# Altium schematic sheet 12V_Buck.SchDoc
size 259 x 167 mm; SheetNumber: 2; SheetTotal: 2
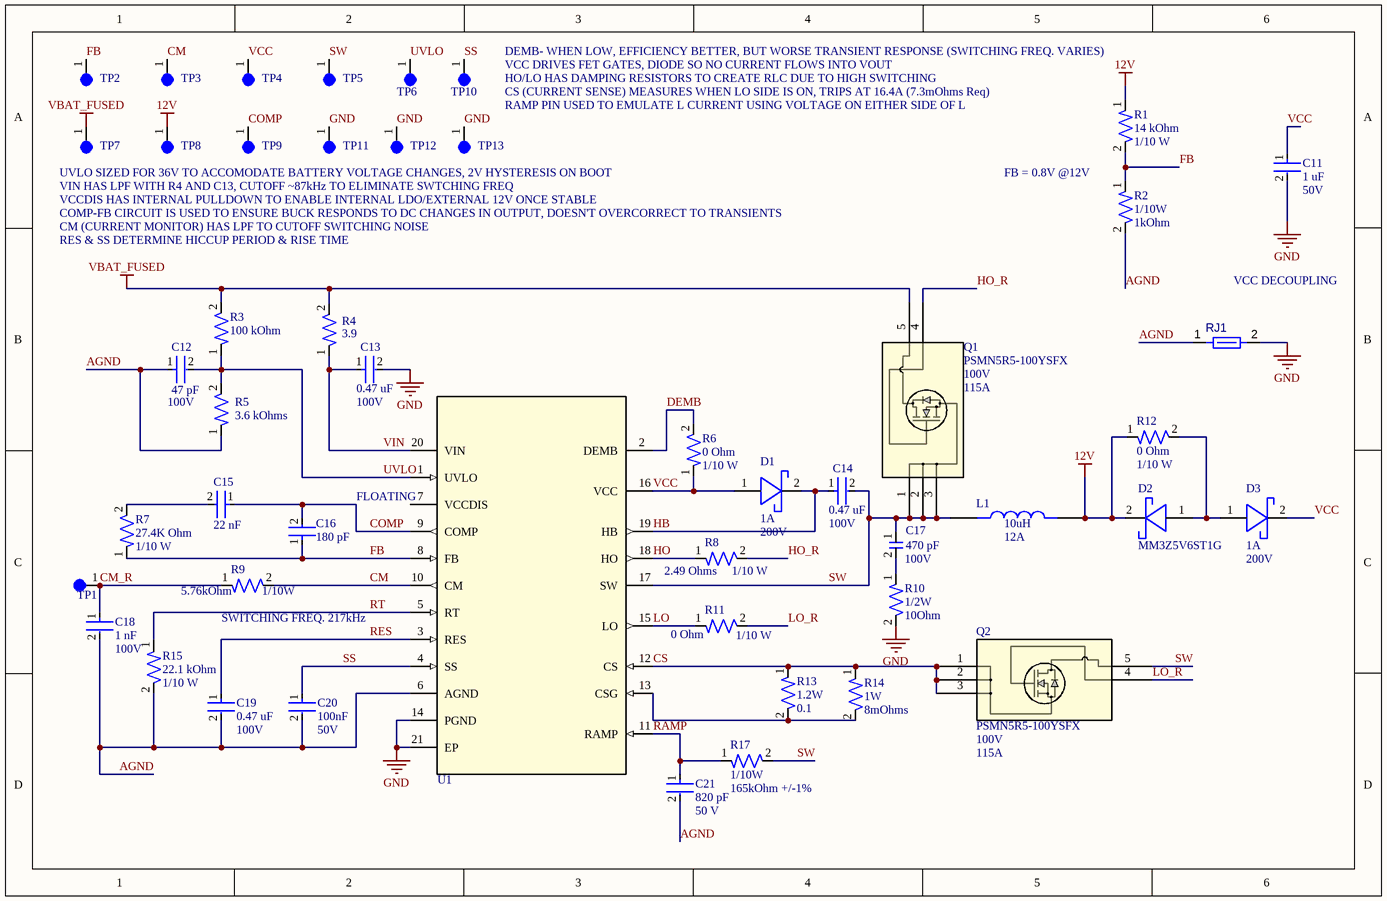
[diagram p0: 12V_Buck.SchDoc]

## Parts
C11  Capacitance: 1 uF  Voltage: 50V  [CAP-0603]  (hidden comment: UMK107AB7105KA-T)
C12  Capacitance: 47 pF  Voltage Rating: 100V  [CAP-0603]  (hidden comment: 7447798111)
C13  Capacitance: 0.47 uF  Voltage: 100V  [CAP-0805]  (hidden comment: KAM21KR72A474KL)
C14  Capacitance: 0.47 uF  Voltage: 100V  [CAP-0805]  (hidden comment: KAM21KR72A474KL)
C15  Capacitance: 22 nF  [CAP-0603]  (hidden comment: C0603C223K3RAC7867)
C16  Capacitance: 180 pF  [CAP-0603]  (hidden comment: CC0603JRNPO9BN181)
C17  Capacitance: 470 pF  voltage: 100V  [CAP-0603]  (hidden comment: 0603B471K101CT)
C18  Capacitance: 1 nF  Voltage: 100V  [CAP-0603]  (hidden comment: C0603Y102K1RAC7867)
C19  Capacitance: 0.47 uF  Voltage: 100V  [CAP-0805]  (hidden comment: KAM21KR72A474KL)
C20  Capacitance: 100nF  Voltage Rating: 50V  [CAP-0603]  (hidden comment: CC0603KRX7R9BB104)
C21  Capacitance: 820 pF  Voltage: 50 V  [CAP-0603]  (hidden comment: C0603C821K5RACTU)
D1  Current Rating: 1A  Reverse Voltage: 200V  [SMA_DIO]  (hidden comment: SS1200)
D2  MM3Z5V6ST1G  [DIO_MM3Z3V0T1G - duplicate]
D3  Current Rating: 1A  Reverse Voltage: 200V  [SMA_DIO]  (hidden comment: SS1200)
L1  value 10uH  Current: 12A  [IND_SRP1265_BRN]  (hidden comment: SRP1265WA-100M)
Q1  PSMN5R5-100YSFX  Vdss: 100V  Drain Current: 115A  [LFPAK_SOT669_NEX]
Q2  PSMN5R5-100YSFX  Vdss: 100V  Drain Current: 115A  [LFPAK_SOT669_NEX]
R1  Resistance: 14 kOhm  Power: 1/10 W  [RES-0603]  (hidden comment: RC0603FR-0714KL)
R2  Power Rating: 1/10W  Resistance: 1kOhm  [RES-0603]  (hidden comment: RT0603FRE131KL)
R3  Resistance: 100 kOhm  [RES-0603]  (hidden comment: RC0603FR-07100KL)
R4  Parameter 1: 3.9  [RES-0805]  (hidden comment: RC0805FR-073R9L)
R5  Resistance: 3.6 kOhms  [RES-0603]  (hidden comment: RC0603FR-073K6L)
R6  Resistance: 0 Ohm  Power: 1/10 W  [RES-0603]  (hidden comment: RMCF0603ZT0R00)
R7  Resistance: 27.4K Ohm  Power: 1/10 W  [RES-0603]  (hidden comment: RC0603FR-0727K4L)
R8  Power: 1/10 W  Resistance: 2.49 Ohms  [RES-0603]  (hidden comment: RC0603FR-072R49L)
R9  Power Rating: 1/10W  Resistance: 5.76kOhm  [RES-0603]  (hidden comment: ARG03FTC5761)
R10  Power Rating: 1/2W  Resistance: 10Ohm  [RES-0603]  (hidden comment: SG73P1JTTD100J)
R11  Resistance: 0 Ohm  Power: 1/10 W  [RES-0603]  (hidden comment: RMCF0603ZT0R00)
R12  Resistance: 0 Ohm  Power: 1/10 W  [RES-0603]  (hidden comment: RMCF0603ZT0R00)
R13  Power: 1.2W  Resistance: 0.1  [RES-0805]  (hidden comment: PE0508FRE070R1L)
R14  Power: 1W  Resistance: 8mOhms  [RES-1206]  (hidden comment: PE1206FKM470R008Z)
R15  Resistance: 22.1 kOhm  Power: 1/10 W  [RES-0603]  (hidden comment: RC0603FR-0722K1L)
R17  Power Rating: 1/10W  Resistance: 165kOhm +/-1%  [RES-0603]  (hidden comment: RC0603FR-07165KL)
RJ1  Net Tie 12x8mil  [SHORT06-FP]  (value not drawn)  (net tie, no BOM)
TP1  5003  [TEST-POINT-0001]  (value not drawn)
TP2  5003  [TEST-POINT-0001]  (value not drawn)
TP3  5003  [TEST-POINT-0001]  (value not drawn)
TP4  5003  [TEST-POINT-0001]  (value not drawn)
TP5  5003  [TEST-POINT-0001]  (value not drawn)
TP6  5003  [TEST-POINT-0001]  (value not drawn)
TP7  5003  [TEST-POINT-0001]  (value not drawn)
TP8  5003  [TEST-POINT-0001]  (value not drawn)
TP9  5003  [TEST-POINT-0001]  (value not drawn)
TP10  5003  [TEST-POINT-0001]  (value not drawn)
TP11  5003  [TEST-POINT-0001]  (value not drawn)
TP12  5003  [TEST-POINT-0001]  (value not drawn)
TP13  5003  [TEST-POINT-0001]  (value not drawn)
U1  LM5117PMHX/NOPB  [IC-20-HTSSOP]  (value not drawn)

## Nets
12V: D2.2 L1.2 R1.1 R12.1 TP8.1
GND: C11.2 C13.2 R10.2 RJ1.2 TP11.1 TP12.1 TP13.1 U1.14(PGND) U1.21(EP)
VBAT_FUSED: Q1.5 R3.2 R4.2 TP7.1
AGND: C12.1 C18.2 C19.2 C20.2 C21.2 R2.2 R5.1 R15.2 RJ1.1 U1.6(AGND)
CM: R9.2 TP3.1 U1.10(CM)
CM_R: C18.1 R9.1 TP1.1
COMP: C15.1 C16.2 TP9.1 U1.9(COMP)
CS: Q2.1 Q2.2 Q2.3 R13.1 R14.1 U1.12(CS)
DEMB: R6.2 U1.2(DEMB)
FB: C16.1 R1.2 R2.1 R7.1 TP2.1 U1.8(FB)
HB: C14.1 D1.2(ANODE) U1.19(HB)
HO: R8.1 U1.18(HO)
HO_R: Q1.4 R8.2
LO: R11.1 U1.15(LO)
LO_R: Q2.4 R11.2
RAMP: C21.1 R17.1 U1.11(RAMP)
RES: C19.1 U1.3(RES)
RT: R15.1 U1.5(RT)
SS: C20.1 TP10.1 U1.4(SS)
SW: C14.2 C17.1 L1.1 Q1.1 Q1.2 Q1.3 Q2.5 R17.2 TP5.1 U1.17(SW)
UVLO: C12.2 R3.1 R5.2 TP6.1 U1.1(UVLO)
VCC: C11.1 D1.1(CATHODE) D3.2(ANODE) R6.1 TP4.1 U1.16(VCC)
VIN: C13.1 R4.1 U1.20(VIN)
NetC15_2: C15.2 R7.2
NetC17_2: C17.2 R10.1
NetD2_1: D2.1 D3.1(CATHODE) R12.2
NetR13_2: R13.2 R14.2 U1.13(CSG)

Not connected (* = marked no-connect by the designer): U1 7(VCCDIS)

## Notes on the sheet
- (near TP10) DEMB- WHEN LOW, EFFICIENCY BETTER, BUT WORSE TRANSIENT RESPONSE (SWITCHING FREQ. VARIES)
- (near TP10) VCC DRIVES FET GATES, DIODE SO NO CURRENT FLOWS INTO VOUT
- (near TP10) HO/LO HAS DAMPING RESISTORS TO CREATE RLC DUE TO HIGH SWITCHING
- CS (CURRENT SENSE) MEASURES WHEN LO SIDE IS ON, TRIPS AT 16.4A (7.3mOhms Req)
- RAMP PIN USED TO EMULATE L CURRENT USING VOLTAGE ON EITHER SIDE OF L
- UVLO SIZED FOR 36V TO ACCOMODATE BATTERY VOLTAGE CHANGES, 2V HYSTERESIS ON BOOT
- FB = 0.8V @12V
- VIN HAS LPF WITH R4 AND C13, CUTOFF ~87kHz TO ELIMINATE SWTCHING FREQ
- VCCDIS HAS INTERNAL PULLDOWN TO ENABLE INTERNAL LDO/EXTERNAL 12V ONCE STABLE
- COMP-FB CIRCUIT IS USED TO ENSURE BUCK RESPONDS TO DC CHANGES IN OUTPUT, DOESN'T OVERCORRECT TO TRANSIENTS
- CM (CURRENT MONITOR) HAS LPF TO CUTOFF SWITCHING NOISE
- RES & SS DETERMINE HICCUP PERIOD & RISE TIME
- VCC DECOUPLING
- (near U1) FLOATING
- (near R9) SWITCHING FREQ. 217kHz

## Library data of the parts
C11 = CAP-1U-0002: 1 µF ±10% 50V Ceramic Capacitor X7R 0603 (1608 Metric); Package Size: 0603
C12 = CAP-47P-0001: 47 pF ±5% 100V Ceramic Capacitor C0G, NP0 0603 (1608 Metric)
C13 C14 C19 = CAP-0.47U-0001: 0.47 µF ±10% 100V Ceramic Capacitor X7R 0805 (2012 Metric); Tolerance: +/- 10%; Assembled?: No; Temperature Coefficient: X7R; Package Size: 0805
C15 = CAP-22N-0001: 0.022 µF ±10% 25V Ceramic Capacitor X7R 0603 (1608 Metric); Package Size: 0603
C16 = CAP-180P-0001: 180 pF ±5% 50V Ceramic Capacitor C0G, NP0 0603 (1608 Metric); Tolerance: +/- 10%; Temperature Coefficient: X7R; Assembled?: No; Package Size: 0805; Voltage: 50V
C17 = CAP-470P-0001: 470 pF ±10% 100V Ceramic Capacitor X7R 0603 (1608 Metric); Assembled?: No; TOlerance: 10%; Package Size: 0603
C18 = CAP-1N-0001: 1000 pF ±10% 100V Ceramic Capacitor X7R 0603 (1608 Metric)
C20 = CAP-100N-0001: 0.1 µF ±10% 50V Ceramic Capacitor X7R 0603 (1608 Metric); Manufacturer Part Number: CC0603KRX7R0BB104; Manufacturer: YAGEO; Assembled?: no; Temperature Coefficient: X7R; Package Size: 0603
C21 = CAP-820P-0001: 820 pF ±10% 50V Ceramic Capacitor X7R 0603 (1608 Metric); Device Class: Ceramic; Size: 0603; ComponentLink1Description: Datasheet; ComponentLink1URL: https://www.yageo.com/upload/media/product/app/datasheet/mlcc/upy-np0x7r_mv_100-to-630v.pdf
D1 D3 = DIO-SCHOTTKY-0004: DIODE SCHOTTKY 200V 1A SMA; ComponentLink1Description: Datasheet; ComponentLink1URL: https://www.digikey.com/en/products/detail/mdd/ss1200/15911596
D2 = TESTDIOZ
L1 = IND-10U-0002: 10 µH Shielded Inductor 12 A 16.5mOhm Max Nonstandard; MP: SRP1265A-100M; Package: None; Price: None; Availability: Unavailable
Q1 Q2 = NMOS-115A-0001: N-Channel 100 V 115A (Tc) 238W (Tc) Surface Mount LFPAK56, Power-SO8; Manufacturer_Part_Number: TPH2R506PL; Vgs (max): 20V; Vgs: 4V @ 1mA; RefDes: RefDes
R1 = RES-14K-0001: 14 kOhms ±1% 0.1W, 1/10W Chip Resistor 0603 (1608 Metric) Moisture Resistant Thick Film; Tolerance: +/- 1%; Assembled?: No; Package Size: 0603
R2 = RES-1K-0002: 1 kOhms ±1% 0.1W, 1/10W Chip Resistor 0603 (1608 Metric) Thin Film; Manufacturer: YAGEO; Assembled?: no; Manufacturer Part Number: RT0603FRE131KL; Package Size: 0603
R3 = RES-100K-0003: 100 kOhms ±1% 0.1W, 1/10W Chip Resistor 0603 (1608 Metric) Moisture Resistant Thick Film; Tolerance: +/- 1%; Assembled?: No; Package Size: 0603; Power: 1/10 W
R4 = RES-3.9-0001: 3.9 Ohms ±1% 0.125W, 1/8W Chip Resistor 0805 (2012 Metric) Moisture Resistant Thick Film
R5 = RES-3.6K-0001: 3.6 kOhms ±1% 0.1W, 1/10W Chip Resistor 0603 (1608 Metric) Moisture Resistant Thick Film; Power: 1/10 W
R6 R11 R12 = RES-0-0001: 0 Ohms Jumper 0.1W, 1/10W Chip Resistor 0603 (1608 Metric) Automotive AEC-Q200 Thick Film; Package Size: 0603
R7 = RES-27.4K-0001: 27.4 kOhms ±1% 0.1W, 1/10W Chip Resistor 0603 (1608 Metric) Moisture Resistant Thick Film; assembled?: yes; JLC part number: C144778
R8 = RES-2.49-0001: 2.49 Ohms ±1% 0.1W, 1/10W Chip Resistor 0603 (1608 Metric) Moisture Resistant Thick Film
R9 = RES-5.76K-0001: 100mW Thin Film Resistor 75V ±25ppm/℃ ±1% -55℃~+155℃ 5.76kΩ 0603 Chip Resistor - Surface Mount ROHS; Manufacturer: Viking Tech; Assembled?: no; Manufacturer Part Number: ARG03FTC5761; Package Size: 0603
R10 = RES-10-0001: 10 Ohms ±5% 0.5W, 1/2W Chip Resistor 0603 (1608 Metric) Automotive AEC-Q200, Pulse Withstanding Thick Film; Manufacturer Part Number: RC0603FR-0710KP; Manufacturer: Vishay; Assembled?: no; Package Size: 0603
R13 = RES-0.1-0001: 100 mOhms ±1% 1.2W Chip Resistor Wide 0805 (2012 Metric), 0508 Automotive AEC-Q200, Current Sense Metal Element
R14 = RES-8mOhms-0001: 8 mOhms ±1% 1W Chip Resistor 1206 (3216 Metric) Current Sense Metal Foil
R15 = RES-22.1K-0001: 22.1 kOhms ±1% 0.1W, 1/10W Chip Resistor 0603 (1608 Metric) Moisture Resistant Thick Film; Assembled?: No; Tolerance: 1%; Package Size: 0603
R17 = RES-165K-0001: 165k Ohms ±1% 0.1W, 1/10W Chip Resistor 0603 (1608 Metric) Moisture Resistant Thick Film; Manufacturer: YAGEO; Assembled?: no; Manufacturer Part Number: RC0603FR-07165KL; Package Size: 0603
RJ1 = CMP-009-00121-2: Max Operating Temperature: 155°C; Pins: 2; Min Operating Temperature: -55°C
TP1-TP13 = TEST-POINT-0001: Oranange PC Test Point, Miniature Phoisphor Bronze Silver Plating Through Hole Mounting Type
U1 = IC-BUCK-0011: Buck Regulator Positive Output Step-Down DC-DC Controller IC 20-HTSSOP; Manufacturer Part Number: TPS62933ODRLR; Manufacturer: Texas Instruments; Assembled?: no; Type: Buck